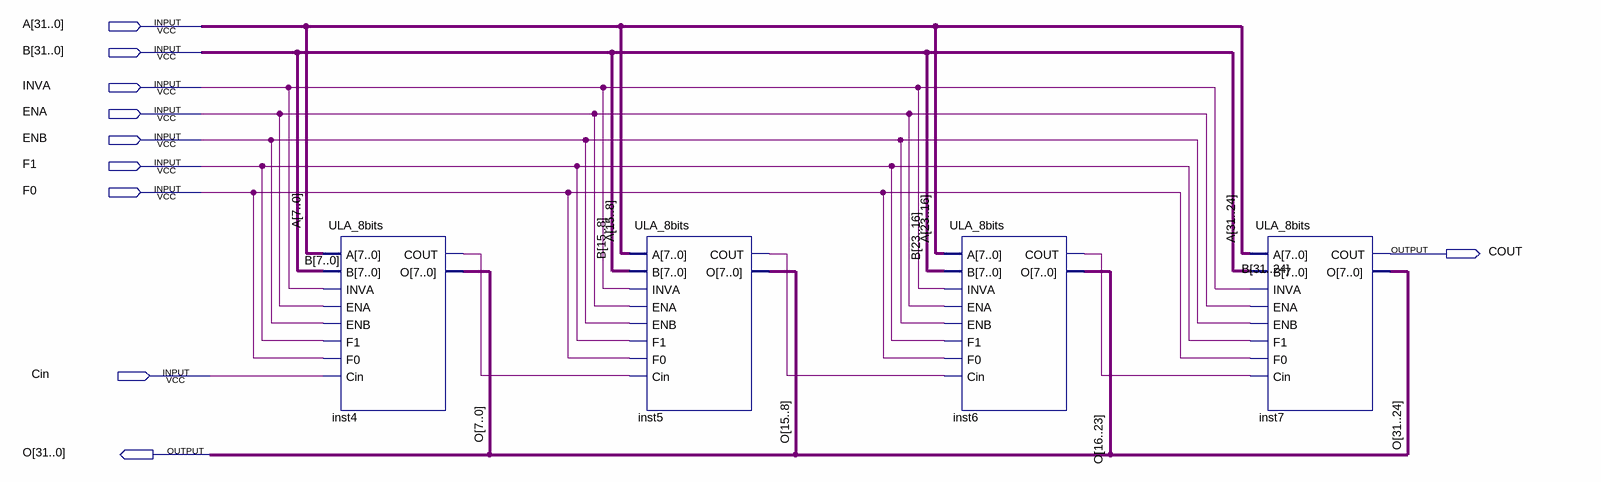
[diagram p0: schematic sheet]
// Quartus schematic ULA_32bits.bdf as structural Verilog: 4 symbols, 10 pins
module ULA_32bits (
  input  [31:0] A,
  input  [31:0] B,
  input  INVA,
  input  ENA,
  input  ENB,
  input  F1,
  input  F0,
  input  Cin,
  output COUT,
  output [31:0] O
);

  wire inst4_cout, inst5_cout, inst6_cout;

  ULA_8bits inst4 (
    .A(A[7:0]), .B(B[7:0]), .INVA(INVA), .ENA(ENA), .ENB(ENB), .F1(F1), .F0(F0), .Cin(Cin),
    .COUT(inst4_cout), .O(O[7:0]));
  ULA_8bits inst5 (
    .A(A[15:8]), .B(B[15:8]), .INVA(INVA), .ENA(ENA), .ENB(ENB), .F1(F1), .F0(F0), .Cin(inst4_cout),
    .COUT(inst5_cout), .O(O[15:8]));
  ULA_8bits inst6 (
    .A(A[23:16]), .B(B[23:16]), .INVA(INVA), .ENA(ENA), .ENB(ENB), .F1(F1), .F0(F0), .Cin(inst5_cout),
    .COUT(inst6_cout), .O({O[16], O[17], O[18], O[19], O[20], O[21], O[22], O[23]}));
  ULA_8bits inst7 (
    .A(A[31:24]), .B(B[31:24]), .INVA(INVA), .ENA(ENA), .ENB(ENB), .F1(F1), .F0(F0), .Cin(inst6_cout),
    .COUT(COUT), .O(O[31:24]));
endmodule
